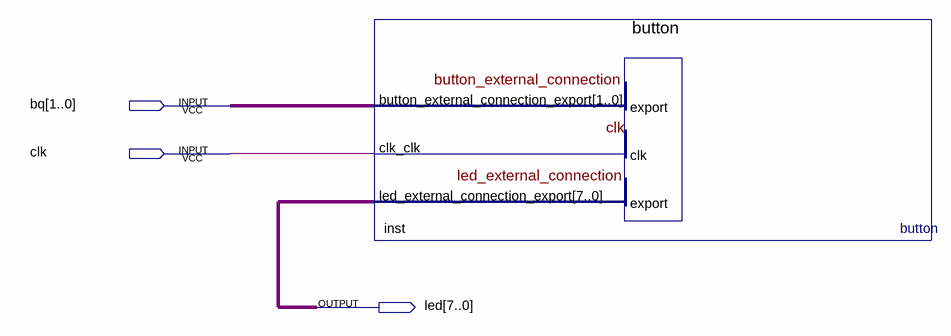
[diagram p0: schematic sheet]
// Quartus schematic sopc.bdf as structural Verilog: 1 symbols, 3 pins
module sopc (
  input  [1:0] bq,
  input  clk,
  output [7:0] led
);

  button inst (.button_external_connection_export(bq), .clk_clk(clk), .led_external_connection_export(led));
endmodule
